# Altium project Inv_Pen_PCB.PrjPcb
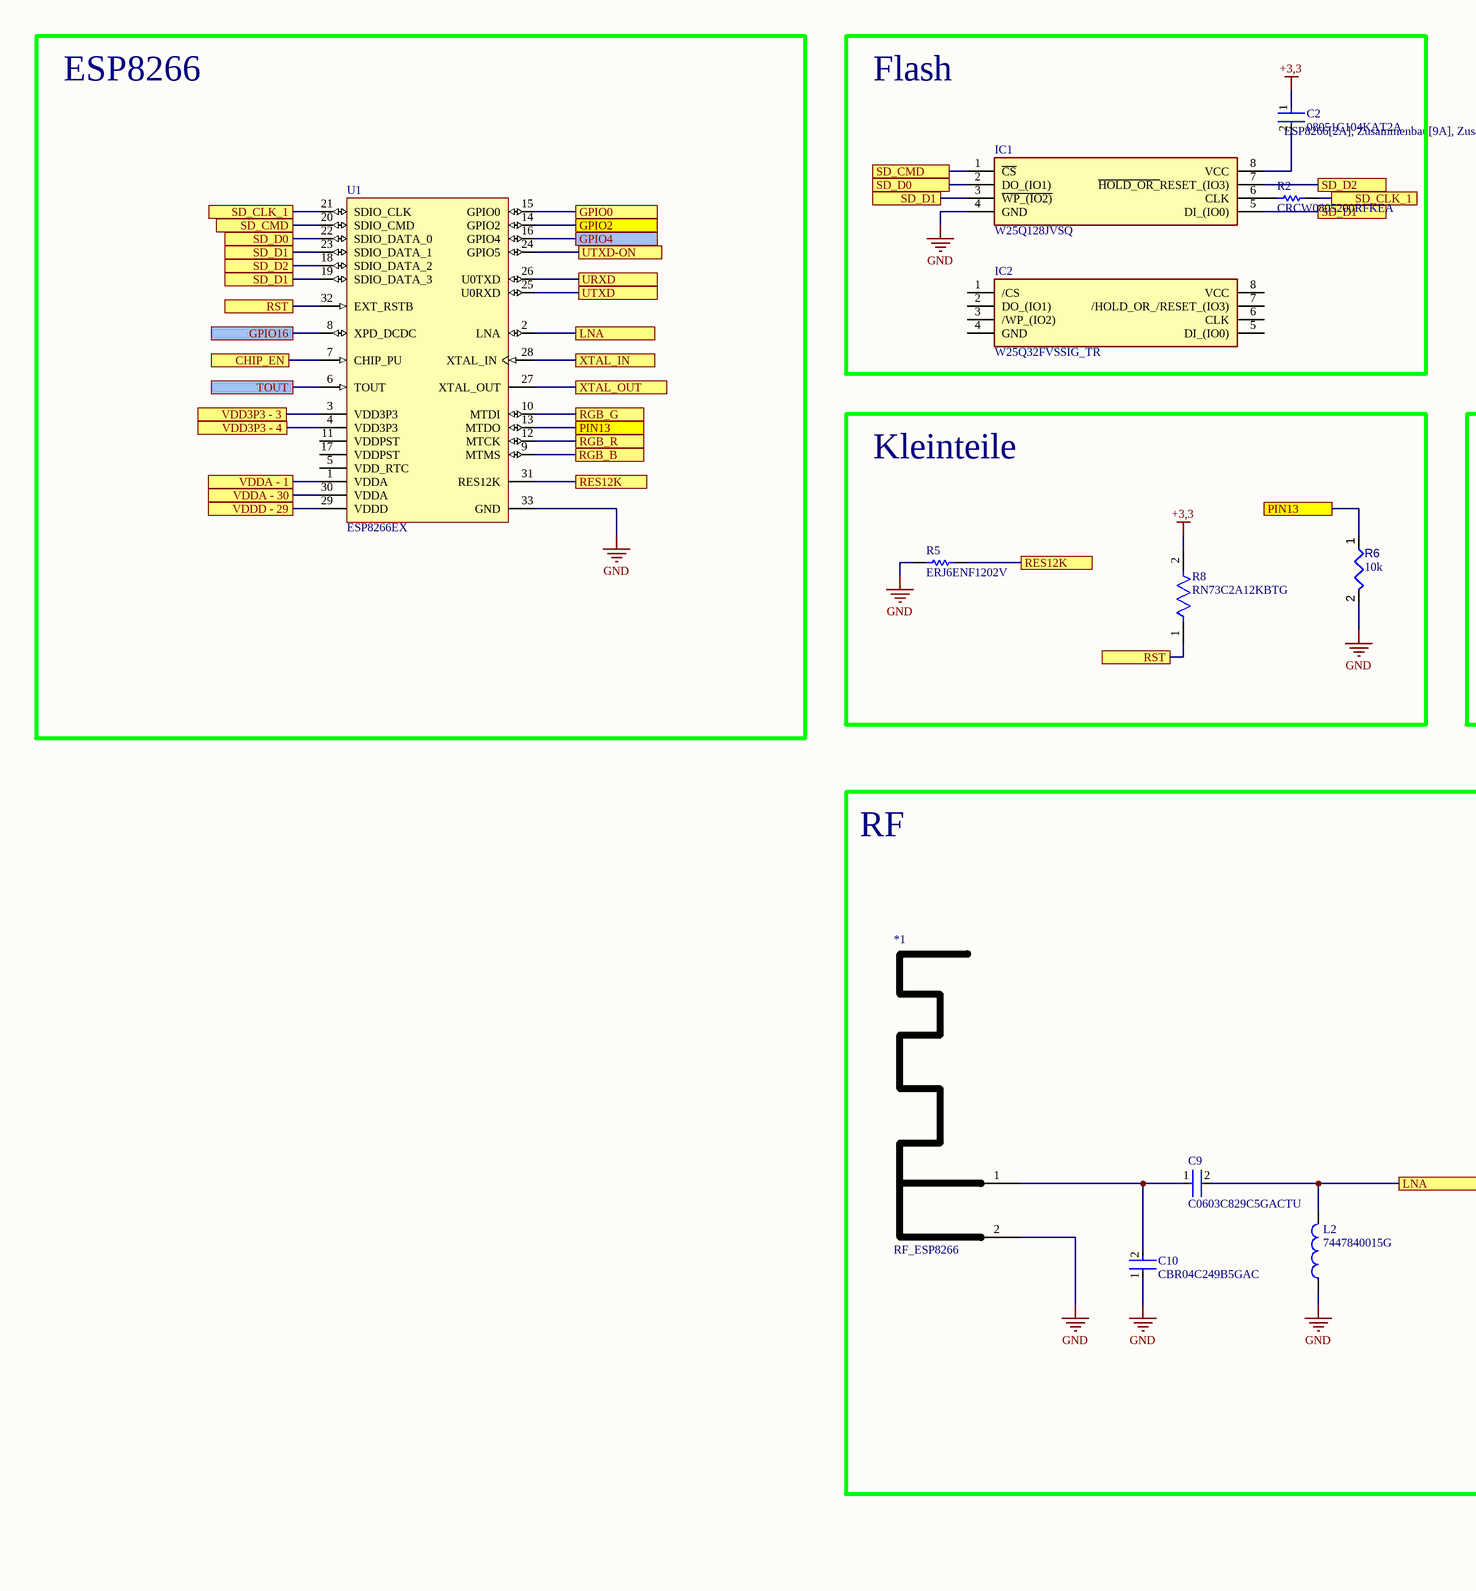
[diagram p0: ESP8266.SchDoc, left]
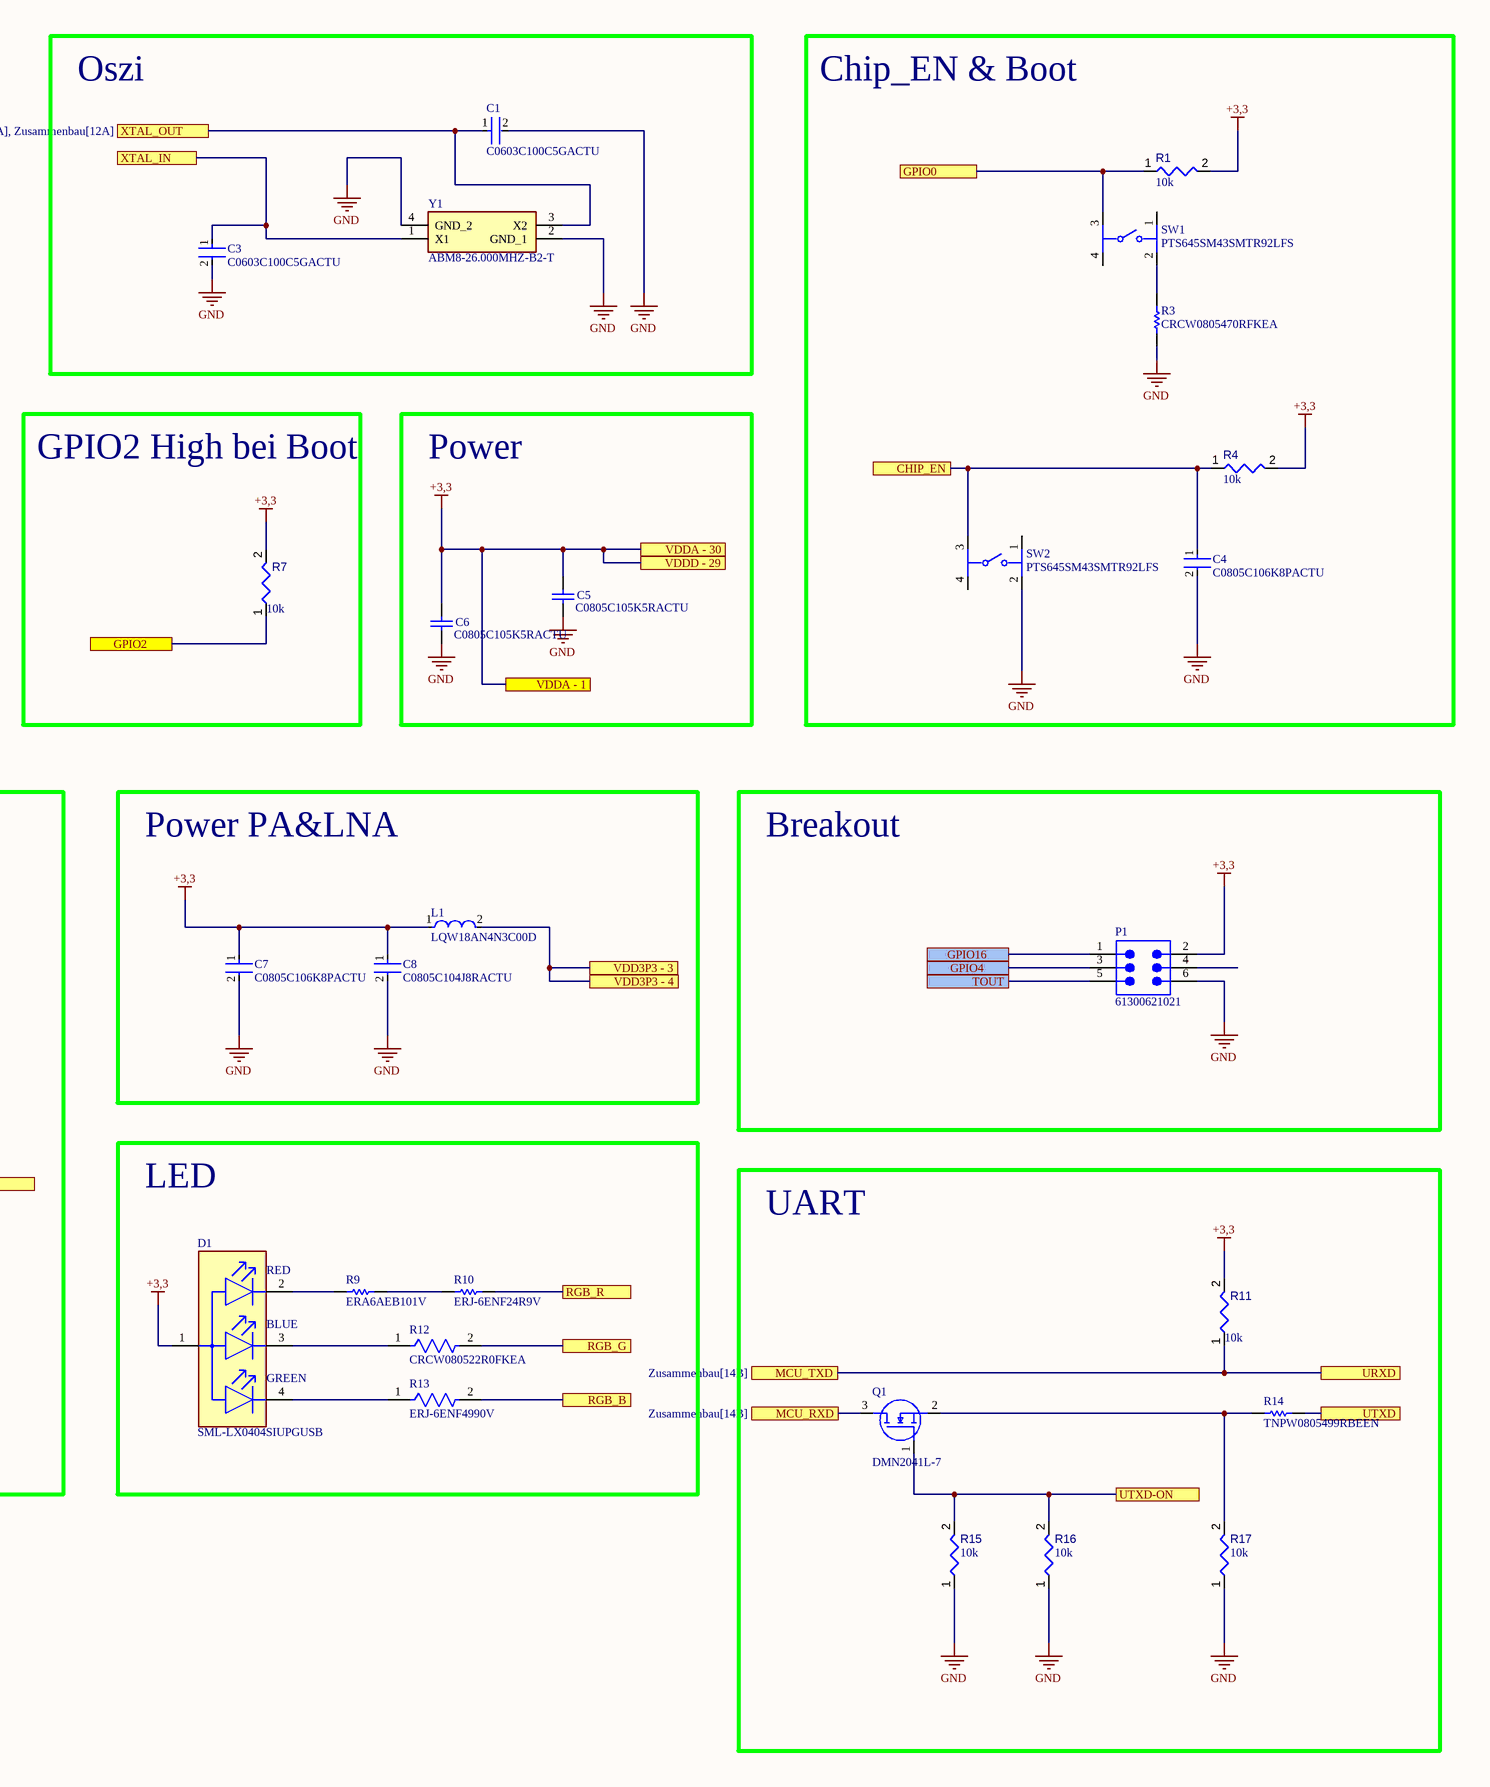
[diagram p1: ESP8266.SchDoc, right]
3 sheets, 39 parts. Net scope: flat (ports and power ports of the same name join across sheets).
Board file: ESP8266.PcbDoc
Sheets:
  ESP8266.SchDoc
  STM32.SchDoc
  UART.SchDoc

## Sheet ESP8266.SchDoc
size A2; SheetNumber: 2; SheetTotal: 3

### Parts
*1  RF_ESP8266  [PCBComponent_1]
C1  C0603C100C5GACTU  [FP-C0603C-CF-MFG]
C2  08051C104KAT2A  [FP-0805-L_2_01_0_2-W_1_25-IPC_B]
C3  C0603C100C5GACTU  [FP-C0603C-CF-MFG]
C4  C0805C106K8PACTU  [FP-C0805C-DG-MFG]
C5  C0805C105K5RACTU  [CAPC2013X140X50ML20T25]
C6  C0805C105K5RACTU  [CAPC2013X140X50ML20T25]
C7  C0805C106K8PACTU  [FP-C0805C-DG-MFG]
C8  C0805C104J8RACTU  [FP-C0805C-DN-MFG]
C9  C0603C829C5GACTU  [FP-C0603C-CF-MFG]
C10  CBR04C249B5GAC  [FP-CBR04C-MFG]
D1  SML-LX0404SIUPGUSB  [FP-SML-LX0404SIUPGUSB-MFG]
IC1  W25Q128JVSQ  [SOIC127P790X216-8N]
IC2  W25Q32FVSSIG_TR  [SOIC127P790X216-8N]
L1  LQW18AN4N3C00D  [FP-LQW18AN_00-MFG]
L2  7447840015G  [WE-MK_0402_L1W0.5H0.5]
P1  61300621021  [61300621021]
Q1  DMN2041L-7  [SOT96P240X110-3N]
R1  value 10k  [RESC2013X50X35ML15T15]  (hidden comment: Resistor 10k +/-1% 0805 125 mW)
R2  CRCW0805200RFKEA  [RESC2013X50X30NL20T20]
R3  CRCW0805470RFKEA  [RESC2013X50X30LL20T20]
R4  value 10k  [RESC2013X50X35ML15T15]  (hidden comment: Resistor 10k +/-1% 0805 125 mW)
R5  ERJ6ENF1202V  [RESC2013X70X40ML20T20]
R6  value 10k  [RESC2013X50X35ML15T15]  (hidden comment: Resistor 10k +/-1% 0805 125 mW)
R7  value 10k  [RESC2013X50X35ML15T15]  (hidden comment: Resistor 10k +/-1% 0805 125 mW)
R8  RN73C2A12KBTG  [FP-RN732A-MFG]
R9  ERA6AEB101V  [RESC2013X60X40ML20T25]
R10  ERJ-6ENF24R9V  [RESC2013X70X40ML20T20]
R11  value 10k  [RESC2013X50X35ML15T15]  (hidden comment: Resistor 10k +/-1% 0805 125 mW)
R12  CRCW080522R0FKEA  [FP-CRCW0805-e3-IPC_C]
R13  ERJ-6ENF4990V  [FP-ERJ6EN-IPC_B]
R14  TNPW0805499RBEEN  [RESC2013X55X40NL15T20]
R15  value 10k  [RESC2013X50X35ML15T15]  (hidden comment: Resistor 10k +/-1% 0805 125 mW)
R16  value 10k  [RESC2013X50X35ML15T15]  (hidden comment: Resistor 10k +/-1% 0805 125 mW)
R17  value 10k  [RESC2013X50X35ML15T15]  (hidden comment: Resistor 10k +/-1% 0805 125 mW)
SW1  PTS645SM43SMTR92LFS  [FP-PTS645SM43SMTR92LFS-MFG]
SW2  PTS645SM43SMTR92LFS  [FP-PTS645SM43SMTR92LFS-MFG]
U1  ESP8266EX  [ESFS-QFN-32_L]
Y1  ABM8-26.000MHZ-B2-T  [ABM810000MHZ12D2W]

### Blocks framed on the sheet
ESP8266: U1
Flash: C2 IC1 IC2 R2
Oszi: C1 C3 Y1
Chip_EN & Boot: C4 R1 R3 R4 SW1 SW2
Kleinteile: R5 R6 R8
GPIO2 High bei Boot: R7
Power: C5 C6
RF: *1 C9 C10 L2
Power PA&LNA: C7 C8 L1
Breakout: P1
LED: D1 R9 R10 R12 R13
UART: Q1 R11 R14-R17

### Ports
CHIP_EN (see ESP8266[1A], Zusammenbau[9A], Zusammenbau[14A]), CHIP_EN (see ESP8266[7A], Zusammenbau[9A], Zusammenbau[14A]), GPIO0 (see ESP8266[2A], Zusammenbau[9A], Zusammenbau[14A]), GPIO0 (see ESP8266[7A], Zusammenbau[9A], Zusammenbau[14A]), GPIO2 (see ESP8266[2A], Zusammenbau[9A], Zusammenbau[12A]), GPIO2 (see ESP8266[5B], Zusammenbau[9A], Zusammenbau[12A]), GPIO4 (see ESP8266[2A], Zusammenbau[9A], Zusammenbau[14B]), GPIO4 (see ESP8266[7B], Zusammenbau[9A], Zusammenbau[14B]), GPIO16 (see ESP8266[1A], Zusammenbau[9A], Zusammenbau[14B]), GPIO16 (see ESP8266[7B], Zusammenbau[9A], Zusammenbau[14B]), LNA (see ESP8266[2A], Zusammenbau[9A], Zusammenbau[12B]), LNA (see ESP8266[4C], Zusammenbau[9A], Zusammenbau[12B]), MCU_RXD (see Zusammenbau[14B]), MCU_TXD (see Zusammenbau[14B]), PIN13 (see ESP8266[2A], Zusammenbau[9A], Zusammenbau[11A]), PIN13 (see ESP8266[4B], Zusammenbau[9A], Zusammenbau[11A]), RES12K (see ESP8266[2A], Zusammenbau[9A], Zusammenbau[11A]), RES12K (see ESP8266[3B], Zusammenbau[9A], Zusammenbau[11A]), RGB_B (see ESP8266[2A], Zusammenbau[9A], Zusammenbau[13B]), RGB_B (see ESP8266[6C], Zusammenbau[9A], Zusammenbau[13B]), RGB_G (see ESP8266[2A], Zusammenbau[9A], Zusammenbau[13B]), RGB_G (see ESP8266[6C], Zusammenbau[9A], Zusammenbau[13B]), RGB_R (see ESP8266[2A], Zusammenbau[9A], Zusammenbau[13B]), RGB_R (see ESP8266[6C], Zusammenbau[9A], Zusammenbau[13B]), RST (see ESP8266[1A], Zusammenbau[9A], Zusammenbau[11A]), RST (see ESP8266[4B], Zusammenbau[9A], Zusammenbau[11A]), SD_CLK_1 (see ESP8266[1A], Zusammenbau[8A], Zusammenbau[11A]), SD_CLK_1 (see ESP8266[4A], Zusammenbau[8A], Zusammenbau[11A]), SD_CMD (see ESP8266[1A], Zusammenbau[9A], Zusammenbau[10A]), SD_CMD (see ESP8266[3A], Zusammenbau[9A], Zusammenbau[10A]), SD_D0 (see ESP8266[1A], Zusammenbau[9A], Zusammenbau[10A]), SD_D0 (see ESP8266[3A], Zusammenbau[9A], Zusammenbau[10A]), SD_D1 (see ESP8266[1A], ESP8266[3A], ESP8266[4A], Zusammenbau[9A], Zusammenbau[10A], Zusammenbau[11A]), SD_D1 (see ESP8266[1A], ESP8266[3A], Zusammenbau[9A], Zusammenbau[10A], Zusammenbau[11A]), SD_D1 (see ESP8266[1A], ESP8266[4A], Zusammenbau[9A], Zusammenbau[10A], Zusammenbau[11A]), SD_D2 (see ESP8266[1A], Zusammenbau[9A], Zusammenbau[11A]), SD_D2 (see ESP8266[4A], Zusammenbau[9A], Zusammenbau[11A]), TOUT (see ESP8266[1A], Zusammenbau[9A], Zusammenbau[14B]), TOUT (see ESP8266[7B], Zusammenbau[9A], Zusammenbau[14B]), URXD (see ESP8266[2A], Zusammenbau[9A], Zusammenbau[15B]), URXD (see ESP8266[8C], Zusammenbau[9A], Zusammenbau[15B]), UTXD (see ESP8266[2A], Zusammenbau[9A], Zusammenbau[15B]), UTXD (see ESP8266[8C], Zusammenbau[9A], Zusammenbau[15B]), UTXD-ON (see ESP8266[2A], Zusammenbau[9A], Zusammenbau[15B]), UTXD-ON (see ESP8266[7C], Zusammenbau[9A], Zusammenbau[15B]), VDD3P3 - 3 (see ESP8266[1A], Zusammenbau[8A], Zusammenbau[13B]), VDD3P3 - 3 (see ESP8266[6B], Zusammenbau[8A], Zusammenbau[13B]), VDD3P3 - 4 (see ESP8266[1A], Zusammenbau[8A], Zusammenbau[13B]), VDD3P3 - 4 (see ESP8266[6B], Zusammenbau[8A], Zusammenbau[13B]), VDDA - 1 (see ESP8266[1A], Zusammenbau[8A], Zusammenbau[13A]), VDDA - 1 (see ESP8266[6B], Zusammenbau[8A], Zusammenbau[13A]), VDDA - 30 (see ESP8266[1A], Zusammenbau[8A], Zusammenbau[13A]), VDDA - 30 (see ESP8266[6B], Zusammenbau[8A], Zusammenbau[13A]), VDDD - 29 (see ESP8266[1B], Zusammenbau[8A], Zusammenbau[13A]), VDDD - 29 (see ESP8266[6B], Zusammenbau[8A], Zusammenbau[13A]), XTAL_IN (see ESP8266[2A], Zusammenbau[9A], Zusammenbau[12A]), XTAL_IN (see ESP8266[5A], Zusammenbau[9A], Zusammenbau[12A]), XTAL_OUT (see ESP8266[2A], Zusammenbau[9A], Zusammenbau[12A]), XTAL_OUT (see ESP8266[5A], Zusammenbau[9A], Zusammenbau[12A])

### Nets
+3,3: C2.1 C5.2 C6.2 C7.1 C8.1 D1.1(Common_Anode) L1.1 P1.2 R1.2 R4.2 R7.2 R8.2 R11.2 U1.1(VDDA) U1.29(VDDD) U1.30(VDDA) ; port VDDA - 30, port VDDD - 29, port VDDA - 1
GND: *1.2(GND) C1.2 C3.2 C4.2 C5.1 C6.1 C7.2 C8.2 C10.1 IC1.4(GND) L2.1 P1.6 R3.1 R5.1 R6.2 R15.1 R16.1 R17.1 SW2.2 U1.33(GND) Y1.2(GND_1) Y1.4(GND_2)
Net*1_1: *1.1(LNA) C9.1 C10.2
NetC1_1: C1.1 U1.27(XTAL_OUT) Y1.3(X2) ; port XTAL_OUT
NetC2_2: C2.2 IC1.8(VCC)
NetC3_1: C3.1 U1.28(XTAL_IN) Y1.1(X1) ; port XTAL_IN
NetC4_1: C4.1 R4.1 SW2.3 U1.7(CHIP_PU) ; port CHIP_EN
NetC9_2: C9.2 L2.2 U1.2(LNA) ; port LNA
NetD1_2: D1.2(Red_C) R9.1
NetD1_3: D1.3(Blue_C) R12.1
NetD1_4: D1.4(Green_C) R13.1
NetIC1_1: IC1.1(~{CS}) U1.20(SDIO_CMD) ; port SD_CMD
NetIC1_2: IC1.2(DO_(IO1)) U1.22(SDIO_DATA_0) ; port SD_D0
NetIC1_3: IC1.3(~{WP_(IO2)}) IC1.5(DI_(IO0)) U1.19(SDIO_DATA_3) U1.23(SDIO_DATA_1) ; port SD_D1
NetIC1_6: IC1.6(CLK) R2.1
NetIC1_7: IC1.7(~{HOLD_OR_}RESET_(IO3)) U1.18(SDIO_DATA_2) ; port SD_D2
NetL1_2: L1.2 U1.3(VDD3P3) U1.4(VDD3P3) ; port VDD3P3 - 3, port VDD3P3 - 4
NetP1_1: P1.1 U1.8(XPD_DCDC) ; port GPIO16
NetP1_3: P1.3 U1.16(GPIO4) ; port GPIO4
NetP1_5: P1.5 U1.6(TOUT) ; port TOUT
NetQ1_1: Q1.1(G) R15.2 R16.2 U1.24(GPIO5) ; port UTXD-ON
NetQ1_2: Q1.2(S) R14.1 R17.2
NetQ1_3: Q1.3(D) ; port MCU_RXD
NetR1_1: R1.1 SW1.3 U1.15(GPIO0) ; port GPIO0
NetR2_2: R2.2 U1.21(SDIO_CLK) ; port SD_CLK_1
NetR3_2: R3.2 SW1.2
NetR5_2: R5.2 U1.31(RES12K) ; port RES12K
NetR6_1: R6.1 U1.13(MTDO) ; port PIN13
NetR7_1: R7.1 U1.14(GPIO2) ; port GPIO2
NetR8_1: R8.1 U1.32(EXT_RSTB) ; port RST
NetR9_2: R9.2 R10.1
NetR10_2: R10.2 U1.12(MTCK) ; port RGB_R
NetR11_1: R11.1 U1.26(U0TXD) ; port URXD, port MCU_TXD
NetR12_2: R12.2 U1.10(MTDI) ; port RGB_G
NetR13_2: R13.2 U1.9(MTMS) ; port RGB_B
NetR14_2: R14.2 U1.25(U0RXD) ; port UTXD

Not connected (* = marked no-connect by the designer): IC2 1(/CS) 2(DO_(IO1)) 3(/WP_(IO2)) 4(GND) 5(DI_(IO0)) 6(CLK) 7(/HOLD_OR_/RESET_(IO3)) 8(VCC); P1 4; SW1 1 4; SW2 1 4; U1 5(VDD_RTC) 11(VDDPST) 17(VDDPST)

### Notes on the sheet
- (near D1) RED
- (near D1) BLUE
- (near D1) GREEN

### Library data of the parts
*1 = CMP-00025-00004-3
C1 C3 = CMP-2006-03343-2: CAP CER 10PF 50V NP0 0603; Manufacturer: KEMET; Material: Ceramic; Temperature Coefficient: 30ppm/°C; Automotive Grade: Grade 1; Tolerance: 0.25 pF; Temperature Characteristic: C0G; Device Class L3: Ceramic Capacitors; Value: 10 pF; Device Class L1: Passive Components; Lead Free: Yes; RoHS: TRUE; Voltage Rating: 50 V; Automotive: Yes; Capacitance: 10 pF; Height: 0.87mm; Temperature Range Low: -55°C; Temperature Range High: +125°C; Mouser Description: Multilayer Ceramic Capacitors MLCC - SMD/SMT 50volts 10pF C0G 0.25%; Device Class L2: Capacitors; Digikey Description: CAP CER 10PF 50V NP0 0603; ComponentLink2Description: Datasheet; Package: C0603C-CF; ComponentLink2URL: https://api.kemet.com/component-edge/download/datasheet/C0603C100J5GACAUTO.pdf; Category: Cap; Octopart: https://octopart.com/c0603c100c5gactu-kemet-9138556; Manufacturer Part Number: C0603C100C5GACTU; Temperature: -55°C to +125°C
C2 = CMP-2007-04174-2: General Purpose Ceramic Capacitor, 0805, 100nF, 10%, X7R, 15%, 100V; Packaging: Tape and Reel; Min Operating Temperature: -55°C; Dielectric Material: Ceramic; Height: 1.4mm; Voltage Rating: 100V; Termination: SMD/SMT; Case Code (Imperial): 0805; Case Code (Metric): 2012; Case/Package: 0805; Construction: Flat; Radiation Hardening: No; Series: -; Dielectric: X7R; Package Quantity: 2000; Mount: Surface Mount; Capacitance: 100nF; Contact Plating: Tin; Voltage: 100V; Lead Free: Lead Free; Depth: 1.25mm; RoHS Compliant: Yes; Number of Pins: 2; Max Operating Temperature: 125°C; Length: 2.01mm; Voltage Rating (DC): 100V; Thickness: 0.055inch; REACH SVHC: No SVHC; Width: 0.049inch; Tolerance: 10%
C4 C7 = CMP-2007-03243-2: CAP CER 10UF 10V X5R 0805; Manufacturer: Kemet; 3DS Part Number: 220-00001; Tolerance: 10%; Temperature Coefficient: 15%; Material: Ceramic; Device Class L2: Capacitors; Device Class L1: Passive Components; ComponentLink2URL: https://content.kemet.com/datasheets/KEM_C1006_X5R_SMD.pdf; Height: 1.4mm; Lead Free: Yes; Manufacturer Part Number: C0805C106K8PACTU; Digikey Description: CAP CER 10UF 10V X5R 0805; Octopart: https://octopart.com/c0805c106k8pactu-kemet-98697; Capacitance: 10uF; Value: 10uF; Temperature Range Low: -55°C; Temperature: -55°C to +85°C; Automotive: No; Mouser Description: CAP CER 10UF 10V X5R 0805; Ipc Land Pattern Name: CAPC200125X125; Temperature Range High: +85°C; Voltage: 10V; RoHS: TRUE; Device Class L3: Ceramic Capacitors; ComponentLink2Description: Datasheet; Voltage Rating: 10V; Package: C0805C-DG; Temperature Characteristic: X5R; Category: Cap
C5 C6 = CMP-2007-03236-1: Manufacturer: Kemet; Part Number: C0805C105K5RACTU
C8 = CMP-03020-032188-1: CAP CER 0.1UF 10V 5% X7R 0805; Manufacturer: KEMET; Material: Ceramic; Tolerance: 0.05; Capacitance: 0.10 μF; Temperature Coefficient: 30ppm/°C; Value: 0.10 μF; Package: C0805C-DN; Device Class L1: Passive Components; Temperature: -55°C to +125°C; Category: Cap; RoHS: TRUE; Mouser Description: Multilayer Ceramic Capacitors MLCC - SMD/SMT 10volts 0.1uF X7R 5%; Lead Free: Yes; Temperature Range Low: -55°C; Temperature Range High: +125°C; Device Class L2: Capacitors; Temperature Characteristic: X7R; Device Class L3: Ceramic Capacitors; ComponentLink2Description: Datasheet; Automotive: No; Ipc Land Pattern Name: CAPC200125X78; Manufacturer Part Number: C0805C104J8RACTU; Voltage Rating: 10 V; Height: 0.88mm; Digikey Description: CAP CER 0.1UF 10V 5% X7R 0805; Octopart: https://octopart.com/c0805c104j8ractu-kemet-11807087; ComponentLink2URL: https://content.kemet.com/datasheets/KEM_C1003_C0G_SMD.pdf
C9 = CMP-2006-03332-2: CAP CER 8.2PF 50V NP0 0603; Manufacturer: KEMET; Temperature Coefficient: 30ppm/°C; Temperature Characteristic: C0G; Material: Ceramic; Tolerance: 0.25 pF; Automotive Grade: Grade 1; Octopart: https://octopart.com/c0603c829c5gactu-kemet-8375751; Automotive: Yes; RoHS: TRUE; Manufacturer Part Number: C0603C829C5GACTU; Temperature Range High: +125°C; Category: Cap; Digikey Description: CAP CER 8.2PF 50V NP0 0603; Value: 8.2 pF; Temperature: -55°C to +125°C; Package: C0603C-CF; Device Class L1: Passive Components; Device Class L3: Ceramic Capacitors; Device Class L2: Capacitors; ComponentLink2Description: Datasheet; Height: 0.87mm; Capacitance: 8.2 pF; Lead Free: Yes; Voltage Rating: 50 V; Mouser Description: Multilayer Ceramic Capacitors MLCC - SMD/SMT 50volts 8.2pF C0G 0.25%; ComponentLink2URL: https://api.kemet.com/component-edge/download/datasheet/C0603C100J5GACAUTO.pdf; Temperature Range Low: -55°C
C10 = CMP-03020-011124-1: CBR0402 2.4 pF 30ppm/°C 0.1 pF C0G 50 V; Manufacturer: KEMET; Capacitance: 2.4 pF; Material: Ceramic; Tolerance: 0.1 pF; Value: 2.4 pF; Voltage Rating: 50 V; Ipc Land Pattern Name: CAPC10050X50; Device Class L3: Ceramic Capacitors; ComponentLink2Description: Datasheet; Category: Cap; Octopart: https://octopart.com/cbr04c249b5gac-kemet-75200062; Temperature Characteristic: C0G; ComponentLink2URL: https://content.kemet.com/datasheets/KEM_C1030_CBR_SMD.pdf; Height: 0.55mm; RoHS: TRUE; Manufacturer Part Number: CBR04C249B5GAC; Package: CBR04C; Temperature Range High: +125°C; Temperature Range Low: -55°C; Temperature: -55°C to +125°C; Device Class L2: Capacitors; Temperature Coefficient: 30ppm/°C; Automotive: No; Lead Free: Yes; Device Class L1: Passive Components
D1 = CMP-2000-07119-2: LED RGB CLEAR SMD; Test Current: 2mA; Wavelength: 465nm; Color: Blue; Lens Style: Square; Power Rating: 30mW; Lens Color: Colorless; Number of LEDs: 3; Viewing Angle: 120°; Luminous Intensity: 20mcd; Forward Voltage: 2.73V; Height: 0.3mm; Lead Free: Lead Free; Max Operating Temperature: 85°C; Mount: Surface Mount; REACH SVHC: No SVHC; Case Code (Imperial): 0404; Forward Current: 2mA; Case Code (Metric): 1010; Lens Transparency: Clear; Length: 1mm; Packaging: Tape and Reel; Min Operating Temperature: -40°C; Package Quantity: 2000; Case/Package: 0404; Width: 1mm
IC1 = W25Q128JVSQ: Integrated Circuit; Manufacturer_Name: Winbond; Datasheet Link: https://www.winbond.com/hq/support/documentation/levelOne.jsp?__locale=en&DocNo=DA00-W25Q128JV; Height: 2.16mm; Manufacturer_Part_Number: W25Q128JVSQ
IC2 = W25Q32FVSSIG_TR: Integrated Circuit; Manufacturer_Name: Winbond; Manufacturer_Part_Number: W25Q32FVSSIG TR; Datasheet Link: https://www.winbond.com/resource-files/w25q32fv revj 06032016.pdf; Height: 2.16mm; Mouser Part Number: N/A; Mouser Price/Stock: https://www.mouser.co.uk/ProductDetail/Winbond/W25Q32FVSSIG-TR?qs=rkhjVJ6%2F3EKsJa4FwxQHwg%3D%3D
L1 = CMP-06042-008021-1: Wire Wound RF Inductor 4.3nH ±0.2nH 850mA 0.059Ω 0603 (1608); Self Resonant Frequency: 6GHz; Series Resistance: 59mR; Shielding: Unshielded; Test Frequency: 100MHz; Current: 750mA; Core Material: Non-Magnetic; Q Factor: 35; Case Code (Imperial): 0603; Mount: Surface Mount; Radiation Hardening: No; Height: 0.8mm; Width: 0.031inch; Length: 1.6mm; Height - Seated (Max): 0.039inch; Current Rating: 850mA; Resistor Type: Wirewound; Package Quantity: 4000; Depth: 1mm; DC Resistance (DCR): 59mR; Termination: SMD/SMT; Max Operating Temperature: 125°C; Military Standard: Not; Min Operating Temperature: -55°C; Case Code (Metric): 1608; DC Current: 850mA; Packaging: Tape and Reel; Inductance: 4.3nH; Max DC Current: 850mA; REACH SVHC: No SVHC; Case/Package: 0603; Weight: 0.000106oz
L2 = CMP-03913-120013755-1: 7447840015G Multilayer Inductor, 1.5Nh, 0.3A, 0402 Rohs Compliant: Yes; Current Rating: 300mA; Width: 500µm; Length: 1mm; Height: 500µm; Max Operating Temperature: 125°C; RoHS: Compliant; Ambient Temperature Range High: 105°C; NexarPartId: 120013755; Inductance: 1.5nH; Ambient Temperature Range Low: -55°C; Min Operating Temperature: -55°C
P1 = CMP-1502-01071-4: NexarPartId: 32855528; Contact Resistance: 20mΩ; Current Rating: 3A; Operating Supply Voltage: 250V; Row Spacing: 2.54mm; Connector Type: Male Pin; Gender: Male; Number of Contacts: 6; Contact Mating Length: 5.9944mm; Number of Rows: 2; REACH SVHC: Unknown; RoHS: Compliant; Termination: Solder; Height: 5.23mm; Number of Pins: 6; Voltage Rating: 250V; Packaging: Bulk; Lead Pitch: 2.54mm; Mount: Through Hole; Max Operating Temperature: 105°C; Color: Black; Number of Positions: 6; Contact Material: Copper; Contact Plating: Gold; Min Operating Temperature: -40°C; Pitch: 2.54mm
Q1 = DMN2041L-7: MOSFET (N-Channel); Manufacturer_Name: Diodes Incorporated; Datasheet Link: https://www.diodes.com//assets/Datasheets/products_inactive_data/DMN2041L.pdf; Height: 1.1mm; Manufacturer_Part_Number: DMN2041L-7; Mouser Part Number: 621-DMN2041L-7; Mouser Price/Stock: https://www.mouser.co.uk/ProductDetail/Diodes-Incorporated/DMN2041L-7?qs=tiksPeNXt0LSbn3jTreVOg%3D%3D; Arrow Part Number: DMN2041L-7; Arrow Price/Stock: https://www.arrow.com/en/products/dmn2041l-7/diodes-incorporated?region=nac
R1 R4 R6 R7 R11 R15-R17 = CMP-009-00018-5: Chip Resistor, 10 KOhm, +/- 1%, 125 mW, -55 to 155 degC, 0805 (2012 Metric); Power: 125mW; Voltage Rating: 150V; Tolerance: 1%; Pins: 2; Min Operating Temperature: -55°C; Case/Package: 0805; Max Operating Temperature: 155°C; RoHS Compliant: True; Mounting Technology: SM
R2 = CMP-2001-03663-1: Manufacturer: Vishay Dale; Part Number: CRCW0805200RFKEA
R3 = CMP-2001-03932-1: Manufacturer: Vishay Dale; Part Number: CRCW0805470RFKEA
R5 = CMP-2001-00513-1: Manufacturer: Panasonic; Part Number: ERJ6ENF1202V
R8 = CMP-03211-006924-1: SMD Chip Resistor, Thin Film, 12KΩ, 100 V, 0805 [2012 Metric], 100 mW, 0.1%, RN73 Series; Manufacturer: TE Connectivity; Power Rating: 0.1W; Temperature Coefficient: 10ppm/°C; Voltage Rating: 100V; Device Class L1: Passive Components; Device Class L2: Resistors; RoHS: TRUE; Temperature Range Low: -55°C; Tolerance: 0.1%; Temperature: -55°C to 155°C; Value: 12KΩ; packaging: 250 cut tape length; Lead Free: Yes; Height: 0.65mm; Ipc Land Pattern Name: RESC200125X55; Automotive: No; Category: Res; ComponentLink2Description: Datasheet; Device Class L3: Chip SMD Resistors; Manufacturer Part Number: RN73C2A12KBTG; Series: RN73; Temperature Range High: 155°C; octopart_url: https://octopart.com/rn73c2a12kbtg-te+connectivity-22737727; Package: RN732A; ComponentLink2URL: https://www.te.com/commerce/DocumentDelivery/DDEController?Action=showdoc&DocId=Data+Sheet%7F1773270%7FP%7Fpdf%7FEnglish%7FENG_DS_1773270_P.pdf%7F1676162-2; Resistance: 12KΩ; Octopart: https://octopart.com/rn73c2a12kbtg-te+connectivity-22737727; Composition: Thin Film
R9 = CMP-2001-00580-1: Manufacturer: Panasonic; Part Number: ERA6AEB101V
R10 = CMP-2001-00076-1: Manufacturer: Panasonic; Part Number: ERJ-6ENF24R9V
R12 = CMP-2001-03692-2: RES Thick Film, 22Ω, 1%, 0.125W, 100ppm/°C, 0805; Resistance: 22R; Power Rating: 125mW; Voltage Rating: 150V; Case/Package: 0805; Radiation Hardening: No; Number of Terminations: 2; Termination: SMD/SMT; Package Quantity: 5000; Weight: 0.000194oz; Mount: Surface Mount; Lead Free: Lead Free; Height: 0.45mm; Composition: Thick Film; Min Operating Temperature: -55°C; Case Code (Metric): 2012; Temperature Coefficient: 100ppm/°C; Depth: 1.25mm; Packaging: Tape and Reel; Contact Plating: Tin; Width: 1.25mm; Case Code (Imperial): 0805; Length: 2mm; Max Operating Temperature: 155°C; Tolerance: 1%; Features: Automotive AEC-Q200; Military Standard: Not; Voltage Rating (DC): 150V; Max Power Dissipation: 125mW
R13 = CMP-2001-00211-2: RES SMD 499 OHM 1% 1/8W 0805; Temperature Coefficient: 100ppm/°C; Working Voltage: 150V; Power Rating: 125mW; Resistance: 499R; Case/Package: 0805; Mount: Surface Mount; Height: 0.6mm; Resistor Type: Thick Film; Length: 2mm; Depth: 1.25mm; Tolerance: 1%; REACH SVHC: No SVHC; RoHS Compliant: Yes; Case Code (Imperial): 0805; Min Operating Temperature: -55°C; Contact Plating: Tin; Lead Free: Lead Free; Construction: Rectangular; Technology: THICK FILM; Termination: SMD/SMT; Features: Automotive AEC-Q200; Case Code (Metric): 2012; Resistance Tolerance: 1%; Voltage Rating: 150V; Max Operating Temperature: 155°C; Series: ERJ; Packaging: Tape and Reel; Radiation Hardening: No; Military Standard: Not; Voltage Rating (DC): 150V; Package Quantity: 1; Max Power Dissipation: 125mW; Number of Terminations: 2; Width: 0.049inch
R14 = CMP-2001-04775-1: Manufacturer: Vishay Dale; Part Number: TNPW0805499RBEEN
SW1 SW2 = CMP-2000-05160-2: SWITCH TACTILE SPST-NO 0.05A 12V; Contact Resistance: 100mR; Throw Configuration: SPST; Illumination Type: Non-Illuminated; Mechanical Life: 100000Cycles; Current Rating: 50mA; Switch Function: Off-Mom; Actuator Length: 0.85mm; Actuator Material: Nylon; Actuator Type: Standard; Operating Force: 160gf; Min Operating Temperature: -20°C; REACH SVHC: No SVHC; Termination: Gull Wing; Case/Package: SMD/SMT; Packaging: Tape and Reel; Mount: Surface Mount; Voltage Rating (DC): 12V; Orientation: Straight; Lead Free: Lead Free; Contact Material: Silver; Color: Black; Max Current Rating: 50mA; Contact Plating: Silver; Depth: 9mm; Package Quantity: 1; Max Voltage Rating (DC): 12V; Length: 6mm; Max Operating Temperature: 60°C
U1 = CMP-2000-07453-1: Low-Power, Highly-Integrated Wi-Fi Solution, 2.5 to 3.6 V, 80 mA, -40 to 125 degC, 32-Pin QFN; Manufacturer: Espressif Systems; Mounting Technology: SurfaceMount; Datasheet URL: http://espressif.com/sites/default/files/documentation/0a-esp8266ex_datasheet_en.pdf; Package Reference: QFN-32; Package Description: 32-Pin Quad Falt No-Lead, Body 5 x 5 mm, Pitch 0.5 mm; Manufacturer URL: http://espressif.com; Datasheet Version: Rev. 5.4, 04/2017
Y1 = ABM8-26.000MHZ-B2-T: Crystal or Oscillator; Manufacturer_Name: ABRACON; Datasheet Link: https://abracon.com/Resonators/abm8.pdf; Height: 0.8mm; Manufacturer_Part_Number: ABM8-26.000MHZ-B2-T

## Sheet STM32.SchDoc
size A3; SheetNumber: 3; SheetTotal: 3

## Sheet UART.SchDoc
size A3; SheetNumber: 2; SheetTotal: 2